# Altium schematic sheet DSO_Counters.SchDoc: Schematic_Name
size A4; CompanyName: University of Melbourne; DrawnBy: Student_#; Engineer: Your Name Here; Organization: University of Melbourne; DocumentNumber: 5; Revision: 0.1; SheetNumber: 5; SheetTotal: 10; Title_Project: Project_Title
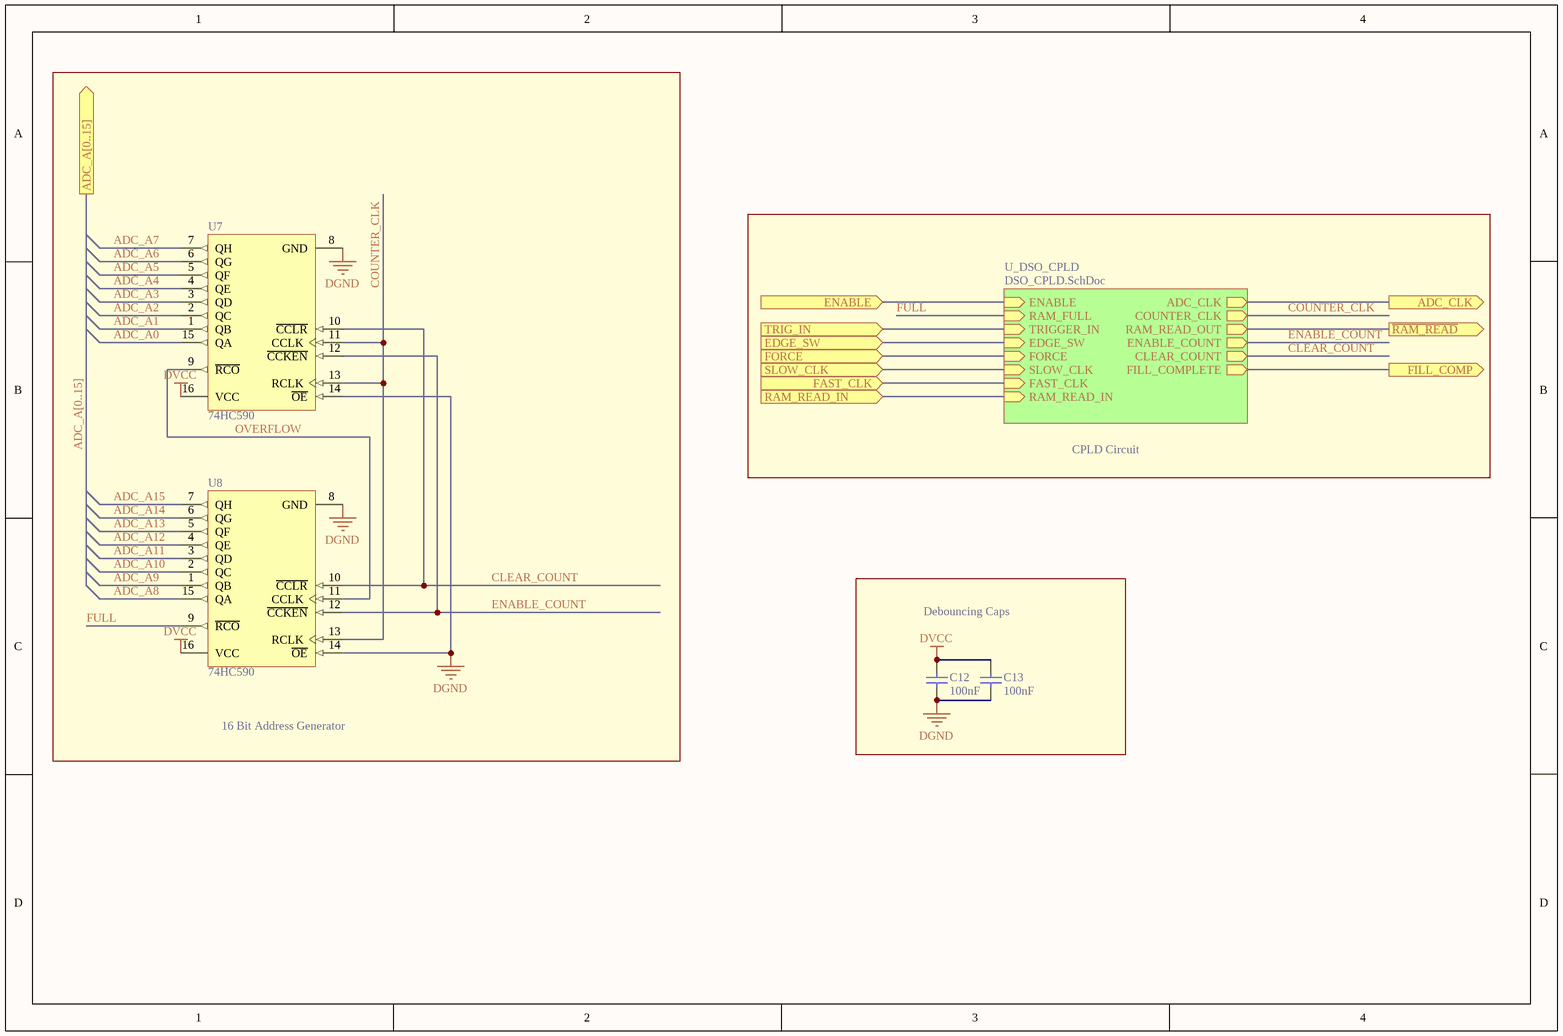
[diagram p0: DSO_Counters.SchDoc]

## Parts
C12  100nF  [0805C]
C13  100nF  [0805C]
U7  74HC590  [SOIC-16]
U8  74HC590  [SOIC-16]

## Blocks framed on the sheet
16 Bit Address Generator: U7 U8
Debouncing Caps: C12 C13

## Sub-sheets
U_DSO_CPLD = DSO_CPLD.SchDoc: ENABLE (in), RAM_FULL (in), TRIGGER_IN (in), EDGE_SW (in), FORCE (in), SLOW_CLK (in), FAST_CLK (in), RAM_READ_IN (in), ADC_CLK (out), COUNTER_CLK (out), RAM_READ_OUT (out), ENABLE_COUNT (out), CLEAR_COUNT (out), FILL_COMPLETE (out)

## Ports
ADC_A[0..15] (out), ADC_CLK (out), EDGE_SW (in), ENABLE (in), FAST_CLK (in), FILL_COMP (out), FORCE (in), RAM_READ_IN (in), SLOW_CLK (in), TRIG_IN (in), ~{RAM_READ} (out)

## Nets
DGND: C12.2 C13.2 U7.8(GND) U7.14(~{OE}) U8.8(GND) U8.14(~{OE})
DVCC: C12.1 C13.1 U7.16(VCC) U8.16(VCC)
ADC_A0: U7.15(QA)
ADC_A1: U7.1(QB)
ADC_A2: U7.2(QC)
ADC_A3: U7.3(QD)
ADC_A4: U7.4(QE)
ADC_A5: U7.5(QF)
ADC_A6: U7.6(QG)
ADC_A7: U7.7(QH)
ADC_A8: U8.15(QA)
ADC_A9: U8.1(QB)
ADC_A10: U8.2(QC)
ADC_A11: U8.3(QD)
ADC_A12: U8.4(QE)
ADC_A13: U8.5(QF)
ADC_A14: U8.6(QG)
ADC_A15: U8.7(QH)
ADC_CLK: port ADC_CLK, sheet U_DSO_CPLD/ADC_CLK
CLEAR_COUNT: U7.10(~{CCLR}) U8.10(~{CCLR}) ; sheet U_DSO_CPLD/CLEAR_COUNT
COUNTER_CLK: U7.11(CCLK) U7.13(RCLK) U8.13(RCLK) ; sheet U_DSO_CPLD/COUNTER_CLK
EDGE_SW: port EDGE_SW, sheet U_DSO_CPLD/EDGE_SW
ENABLE: port ENABLE, sheet U_DSO_CPLD/ENABLE
ENABLE_COUNT: U7.12(~{CCKEN}) U8.12(~{CCKEN}) ; sheet U_DSO_CPLD/ENABLE_COUNT
FAST_CLK: port FAST_CLK, sheet U_DSO_CPLD/FAST_CLK
FILL_COMP: port FILL_COMP, sheet U_DSO_CPLD/FILL_COMPLETE
FORCE: port FORCE, sheet U_DSO_CPLD/FORCE
FULL: U8.9(~{RCO}) ; sheet U_DSO_CPLD/RAM_FULL
OVERFLOW: U7.9(~{RCO}) U8.11(CCLK)
~{RAM_READ}: port ~{RAM_READ}, sheet U_DSO_CPLD/RAM_READ_OUT
RAM_READ_IN: port RAM_READ_IN, sheet U_DSO_CPLD/RAM_READ_IN
SLOW_CLK: port SLOW_CLK, sheet U_DSO_CPLD/SLOW_CLK
TRIG_IN: port TRIG_IN, sheet U_DSO_CPLD/TRIGGER_IN

## Buses and harness runs
bus ADC_A[0..15] = port ADC_A[0..15]

## Notes on the sheet
- CPLD Circuit

## Library data of the parts
C12 C13 = C: Capacitor; Reviewed by: RM - 2018/08/05; Revision: July-2002: Re-released for DXP Platform.; Value: 100nF; Supplier 1: *; Supplier Part Number 1: *
U7 U8 = 74HC590: 8-Bit Binary Counter Register; Reviewed by: RM - 2018/08/05; ComponentLink1Description: Manufacturer Link; ComponentLink1URL: http://www.st.com/; ComponentLink2Description: Datasheet; ComponentLink2URL: http://www.st.com/stonline/products/literature/ds/1986/m74hc590.pdf; Supplier 1: Digi-Key; Supplier Part Number 1: 296-17132-1-ND